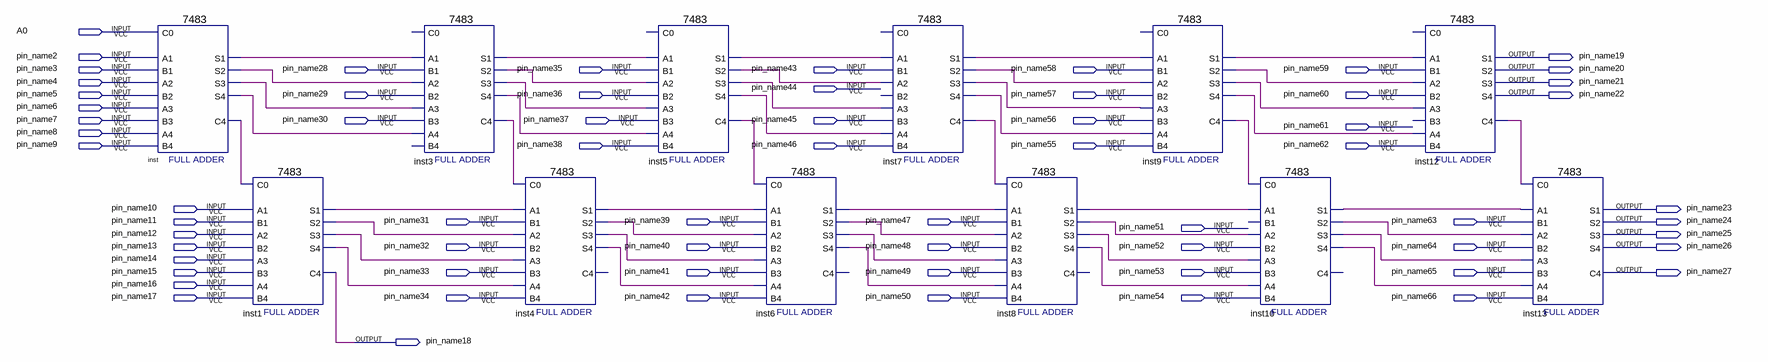
[diagram p0: schematic sheet]
// Quartus schematic add.bdf as structural Verilog: 12 symbols, 66 pins
module add (
  input  A0,
  input  pin_name2,
  input  pin_name3,
  input  pin_name28,
  input  pin_name35,
  input  pin_name43,
  input  pin_name58,
  input  pin_name59,
  input  pin_name4,
  input  pin_name44,
  input  pin_name5,
  input  pin_name29,
  input  pin_name36,
  input  pin_name57,
  input  pin_name60,
  input  pin_name6,
  input  pin_name7,
  input  pin_name30,
  input  pin_name37,
  input  pin_name45,
  input  pin_name56,
  input  pin_name61,
  input  pin_name8,
  input  pin_name9,
  input  pin_name38,
  input  pin_name46,
  input  pin_name55,
  input  pin_name62,
  input  pin_name10,
  input  pin_name11,
  input  pin_name31,
  input  pin_name39,
  input  pin_name47,
  input  pin_name63,
  input  pin_name51,
  input  pin_name12,
  input  pin_name13,
  input  pin_name32,
  input  pin_name40,
  input  pin_name48,
  input  pin_name52,
  input  pin_name64,
  input  pin_name14,
  input  pin_name15,
  input  pin_name33,
  input  pin_name41,
  input  pin_name49,
  input  pin_name53,
  input  pin_name65,
  input  pin_name16,
  input  pin_name17,
  input  pin_name34,
  input  pin_name42,
  input  pin_name50,
  input  pin_name54,
  input  pin_name66,
  output pin_name19,
  output pin_name20,
  output pin_name21,
  output pin_name22,
  output pin_name23,
  output pin_name24,
  output pin_name25,
  output pin_name26,
  output pin_name27,
  output pin_name18
);

  wire inst1_s1, inst1_s2, inst1_s3, inst1_s4, inst3_c4, inst3_s1, inst3_s2, inst3_s3, inst3_s4, inst4_s1,
       inst4_s2, inst4_s3, inst4_s4, inst5_c4, inst5_s1, inst5_s2, inst5_s3, inst5_s4, inst6_s1, inst6_s2,
       inst6_s3, inst6_s4, inst7_c4, inst7_s1, inst7_s2, inst7_s3, inst7_s4, inst8_s1, inst8_s2, inst8_s3,
       inst8_s4, inst9_c4, inst9_s1, inst9_s2, inst9_s3, inst9_s4, inst10_s1, inst10_s2, inst10_s3,
       inst10_s4, inst12_c4, inst_c4, inst_s1, inst_s2, inst_s3, inst_s4;

  \7483  inst (
    .B4(pin_name9), .C0(A0), .A1(pin_name2), .A2(pin_name4), .B1(pin_name3), .B2(pin_name5), .A3(pin_name6),
    .B3(pin_name7), .A4(pin_name8), .S3(inst_s3), .S4(inst_s4), .S2(inst_s2), .C4(inst_c4), .S1(inst_s1));
  \7483  inst1 (
    .B4(pin_name17), .C0(inst_c4), .A1(pin_name10), .A2(pin_name12), .B1(pin_name11), .B2(pin_name13),
    .A3(pin_name14), .B3(pin_name15), .A4(pin_name16), .S3(inst1_s3), .S4(inst1_s4), .S2(inst1_s2),
    .C4(pin_name18), .S1(inst1_s1));
  \7483  inst3 (
    .A1(inst_s1), .A2(inst_s2), .B1(pin_name28), .B2(pin_name29), .A3(inst_s3), .B3(pin_name30),
    .A4(inst_s4), .S3(inst3_s3), .S4(inst3_s4), .S2(inst3_s2), .C4(inst3_c4), .S1(inst3_s1));  // open: B4, C0
  \7483  inst4 (
    .B4(pin_name34), .C0(inst3_c4), .A1(inst1_s1), .A2(inst1_s2), .B1(pin_name31), .B2(pin_name32),
    .A3(inst1_s3), .B3(pin_name33), .A4(inst1_s4), .S3(inst4_s3), .S4(inst4_s4), .S2(inst4_s2), .S1(inst4_s1));  // open: C4
  \7483  inst5 (
    .B4(pin_name38), .A1(inst3_s1), .A2(inst3_s2), .B1(pin_name35), .B2(pin_name36), .A3(inst3_s3),
    .A4(inst3_s4), .S3(inst5_s3), .S4(inst5_s4), .S2(inst5_s2), .C4(inst5_c4), .S1(inst5_s1));  // open: C0, B3
  \7483  inst6 (
    .B4(pin_name42), .C0(inst5_c4), .A1(inst4_s1), .A2(inst4_s2), .B1(pin_name39), .B2(pin_name40),
    .A3(inst4_s3), .B3(pin_name41), .A4(inst4_s4), .S3(inst6_s3), .S4(inst6_s4), .S2(inst6_s2), .S1(inst6_s1));  // open: C4
  \7483  inst7 (
    .B4(pin_name46), .A1(inst5_s1), .A2(inst5_s2), .B1(pin_name43), .A3(inst5_s3), .B3(pin_name45),
    .A4(inst5_s4), .S3(inst7_s3), .S4(inst7_s4), .S2(inst7_s2), .C4(inst7_c4), .S1(inst7_s1));  // open: C0, B2
  \7483  inst8 (
    .B4(pin_name50), .C0(inst7_c4), .A1(inst6_s1), .A2(inst6_s2), .B1(pin_name47), .B2(pin_name48),
    .A3(inst6_s3), .B3(pin_name49), .A4(inst6_s4), .S3(inst8_s3), .S4(inst8_s4), .S2(inst8_s2), .S1(inst8_s1));  // open: C4
  \7483  inst9 (
    .B4(pin_name55), .A1(inst7_s1), .A2(inst7_s2), .B1(pin_name58), .B2(pin_name57), .A3(inst7_s3),
    .B3(pin_name56), .A4(inst7_s4), .S3(inst9_s3), .S4(inst9_s4), .S2(inst9_s2), .C4(inst9_c4), .S1(inst9_s1));  // open: C0
  \7483  inst10 (
    .B4(pin_name54), .C0(inst9_c4), .A1(inst8_s1), .A2(inst8_s2), .B2(pin_name52), .A3(inst8_s3),
    .B3(pin_name53), .A4(inst8_s4), .S3(inst10_s3), .S4(inst10_s4), .S2(inst10_s2), .S1(inst10_s1));  // open: B1, C4
  \7483  inst12 (
    .B4(pin_name62), .A1(inst9_s1), .A2(inst9_s2), .B1(pin_name59), .B2(pin_name60), .A3(inst9_s3),
    .A4(inst9_s4), .S3(pin_name21), .S4(pin_name22), .S2(pin_name20), .C4(inst12_c4), .S1(pin_name19));  // open: C0, B3
  \7483  inst13 (
    .B4(pin_name66), .C0(inst12_c4), .A1(inst10_s1), .A2(inst10_s2), .B1(pin_name63), .B2(pin_name64),
    .A3(inst10_s3), .B3(pin_name65), .A4(inst10_s4), .S3(pin_name25), .S4(pin_name26), .S2(pin_name24),
    .C4(pin_name27), .S1(pin_name23));
endmodule
